# Altium schematic sheet PetroTankMonitor.SchDoc
size A2
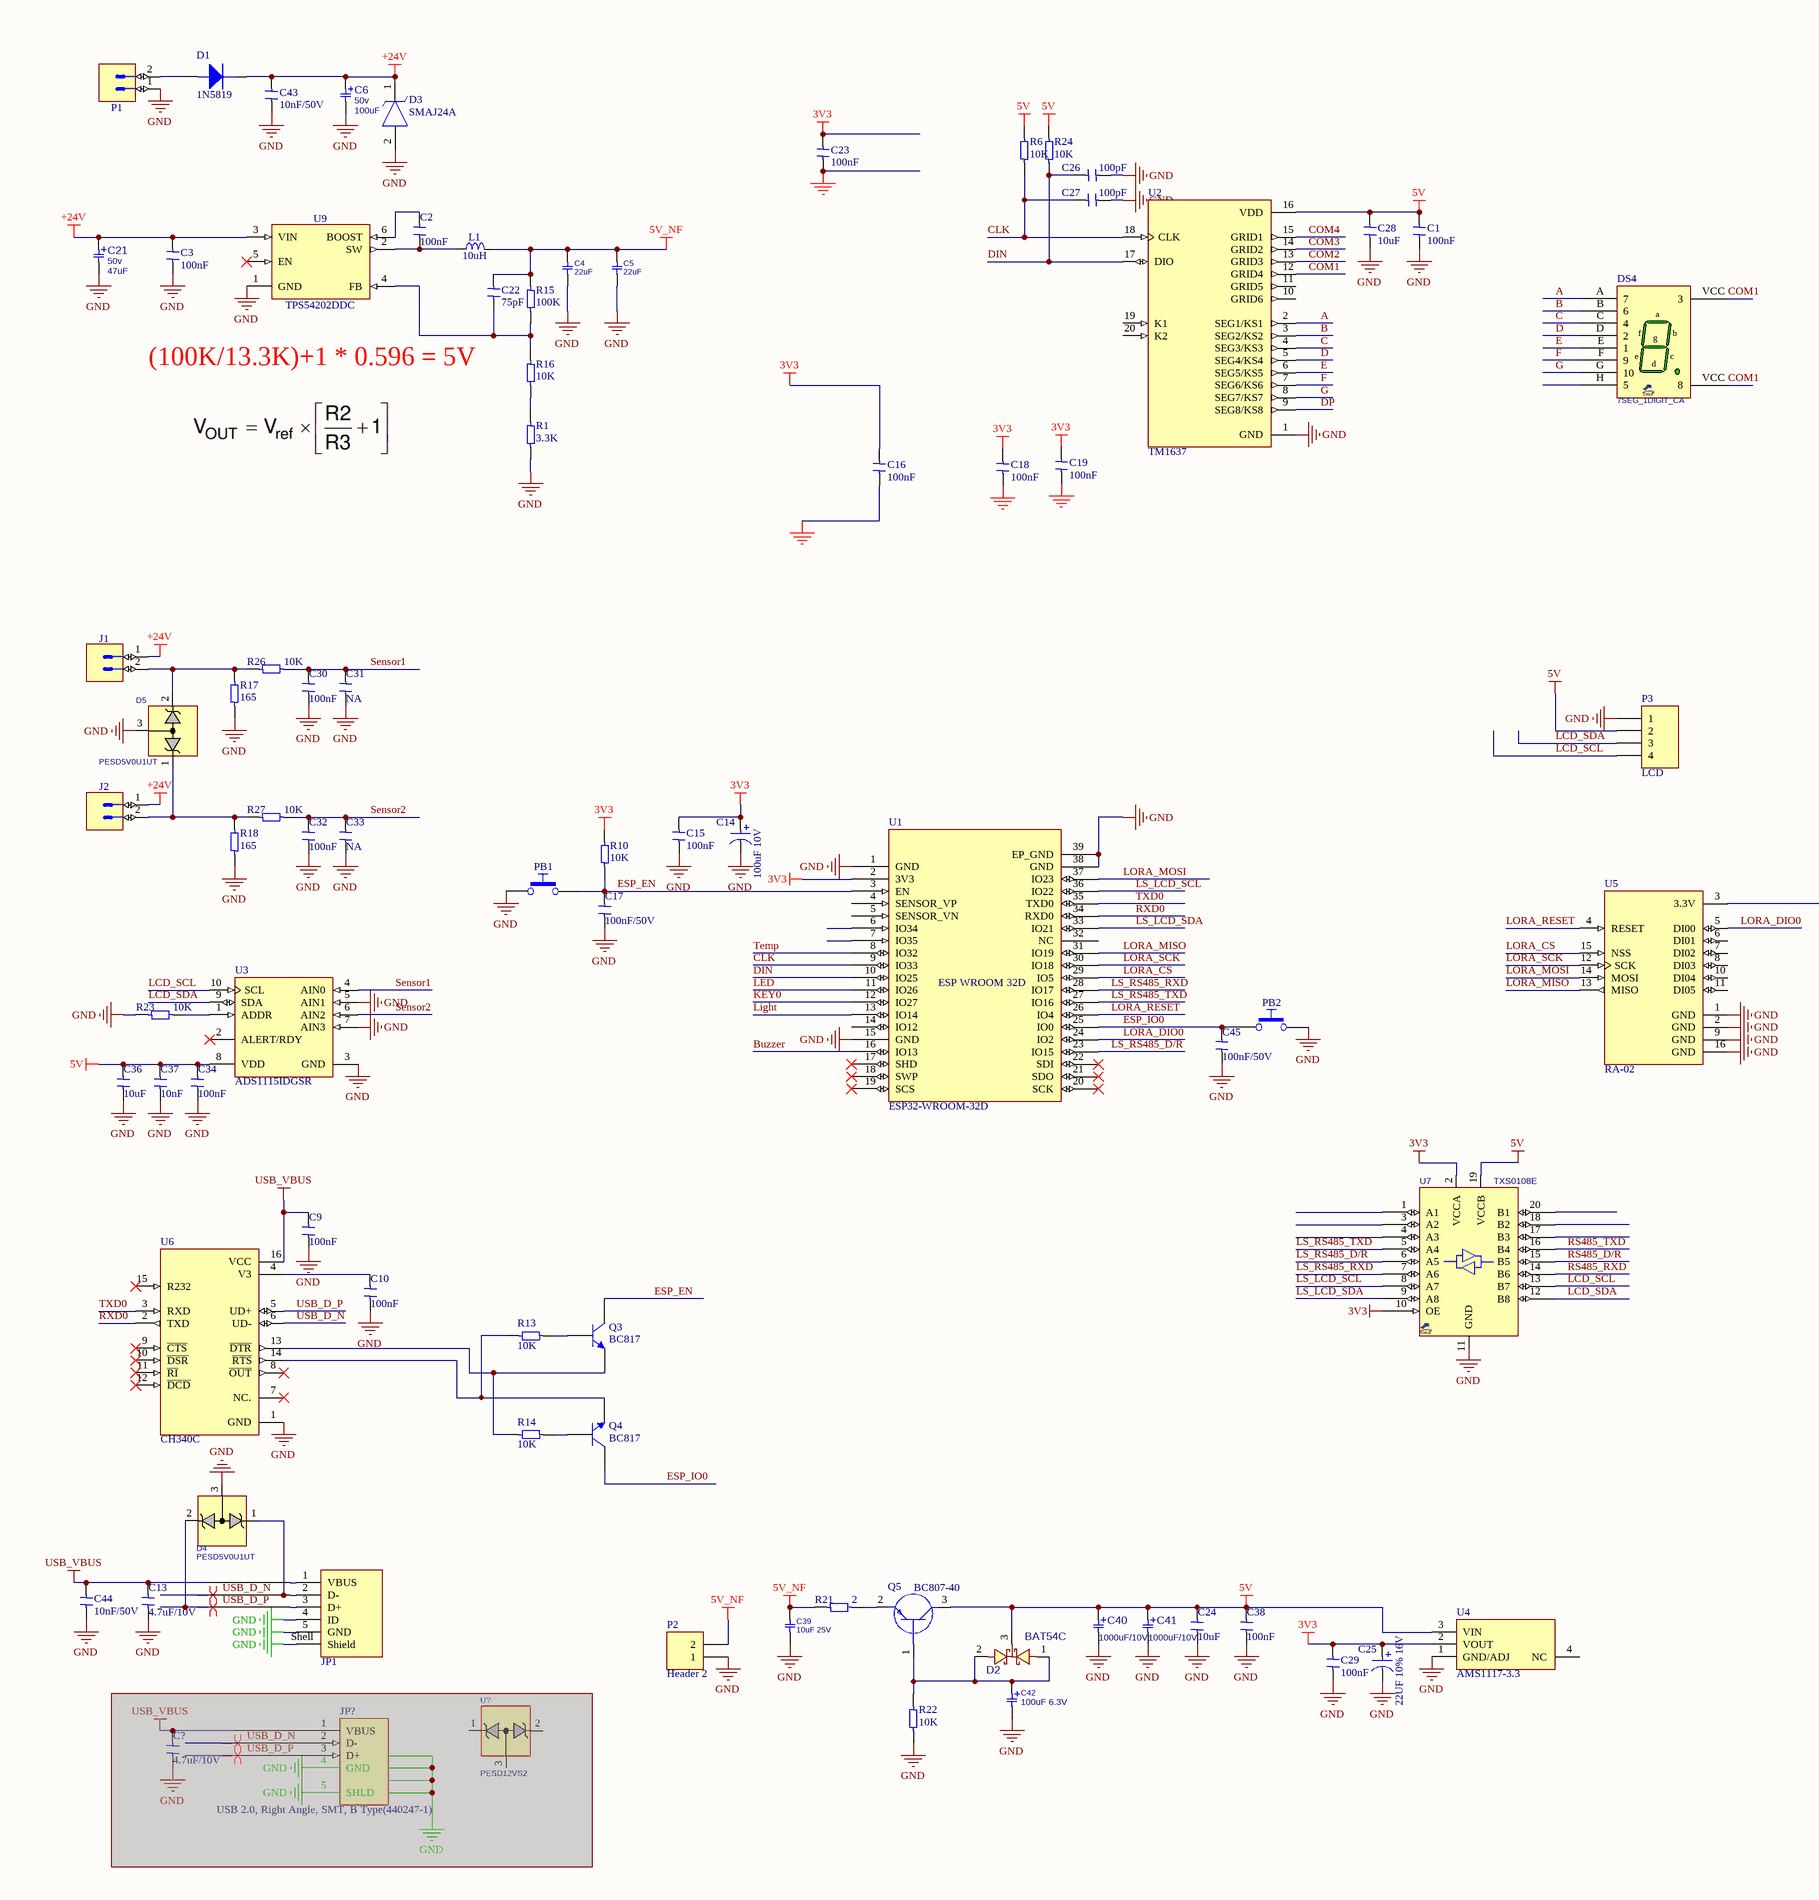
[diagram p0: PetroTankMonitor.SchDoc, left]
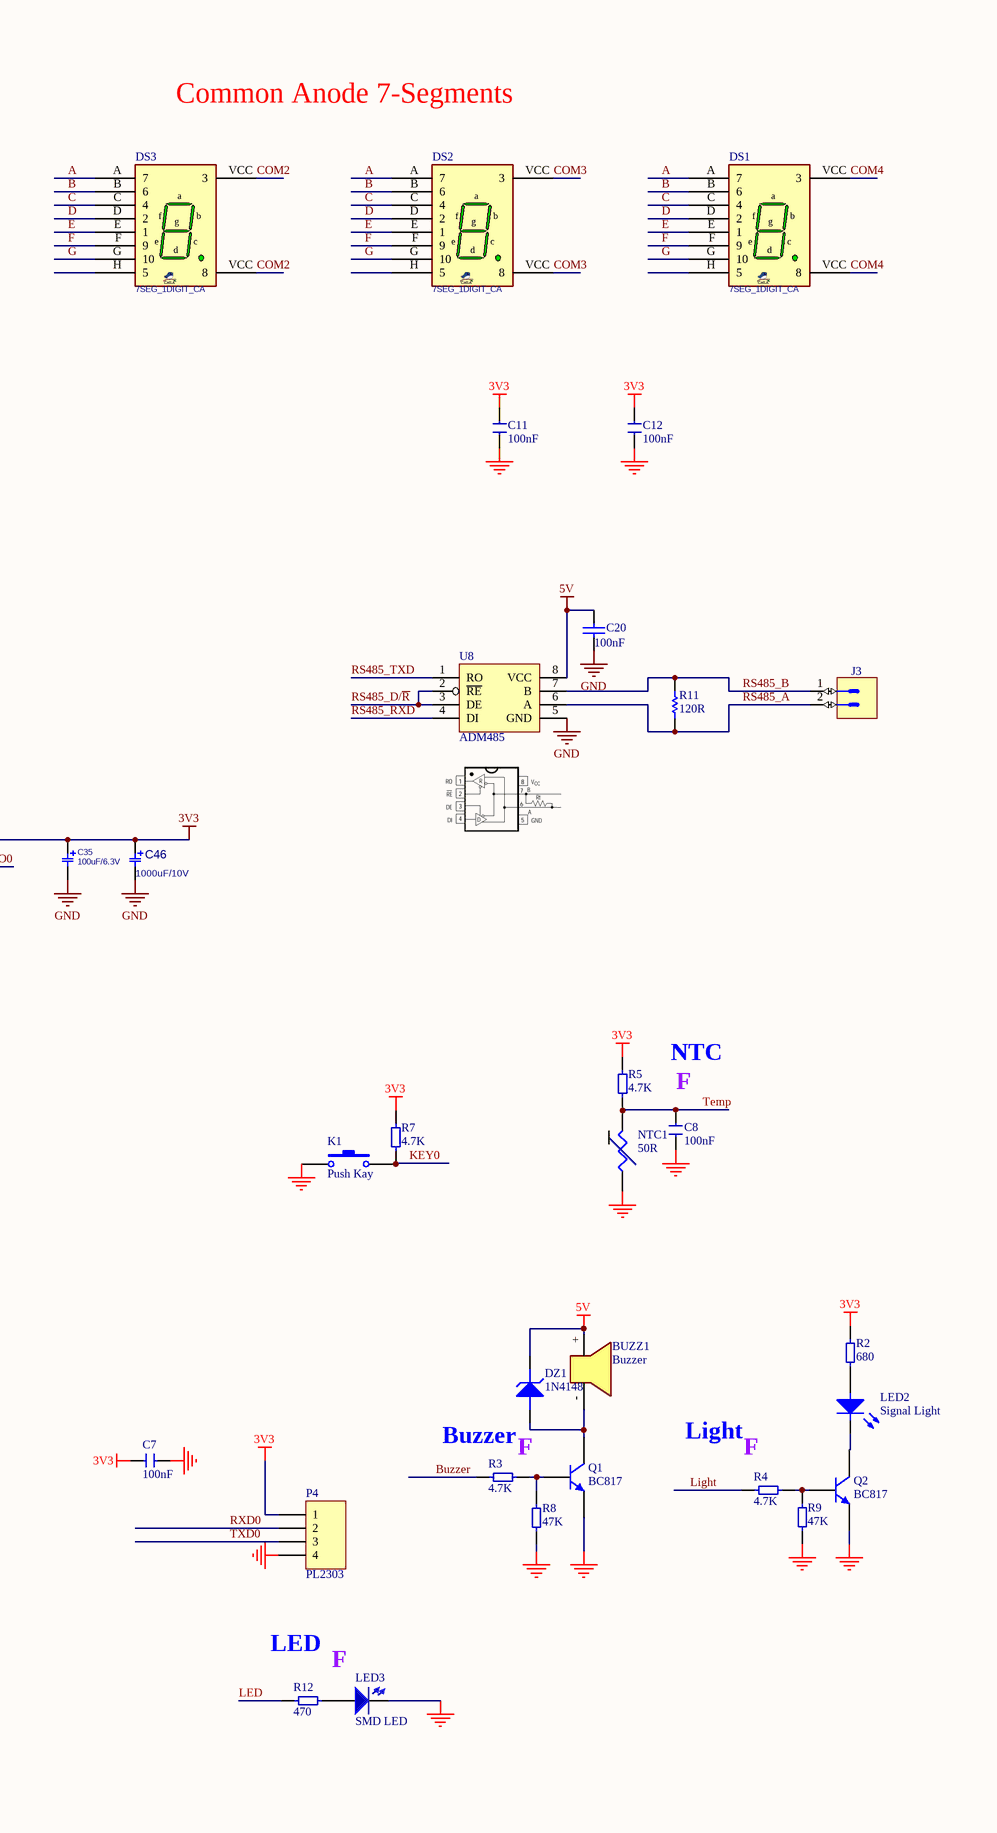
[diagram p1: PetroTankMonitor.SchDoc, right]

## Parts
BUZZ1  Buzzer  [My_Buzzer]
C1  Capacitor SMD  [0805 Capacitor]  (value not drawn)
C2  100nF  [0805 Capacitor]
C3  100nF  [0805 Capacitor]
C4  22uF  [C1206E]
C5  22uF  [C1206E]
C6  PARAM2: 50v  [C_EL_8X12]  (hidden comment: 100uF)
C7  100nF  [0805 Capacitor]
C8  100nF  [0805 Capacitor]
C9  100nF  [0805 Capacitor]
C10  100nF  [0805 Capacitor]
C11  100nF  [0805 Capacitor]
C12  100nF  [0805 Capacitor]
C13  4.7uF/10V  [0805 Capacitor]
C14  100uF 10V  [Tantalum-B]
C15  100nF  [0805 Capacitor]
C16  100nF  [0805 Capacitor]
C17  100nF/50V  [0805 Capacitor]
C18  100nF  [0805 Capacitor]
C19  100nF  [0805 Capacitor]
C20  100nF  [0805 Capacitor]
C21  PARAM2: 50v  [C_EL_6X12]  (hidden comment: 47uF)
C22  75pF  [0805 Capacitor]
C23  100nF  [0805 Capacitor]
C24  10uF  [0805 Capacitor]
C25  22UF 10% 16V  [Tantalum-B]
C26  100pF  [0805 Capacitor]
C27  100pF  [0805 Capacitor]
C28  10uF  [0805 Capacitor]
C29  100nF  [0805 Capacitor]
C30  100nF  [0805 Capacitor]
C31  NA  [0805 Capacitor]
C32  100nF  [0805 Capacitor]
C33  NA  [0805 Capacitor]
C34  100nF  [0805 Capacitor]
C35  100uF/6.3V  [C_TN_7343]
C36  10uF  [0805 Capacitor]
C37  10nF  [0805 Capacitor]
C38  100nF  [0805 Capacitor]
C39  10uF 25V  [C1206E]
C40  1000uF/10V  [C_EL_10X16]
C41  1000uF/10V  [C_EL_10X16]
C42  100uF 6.3V  [C_TN_3528]
C43  10nF/50V  [0805 Capacitor]
C44  10nF/50V  [0805 Capacitor]
C45  100nF/50V  [0805 Capacitor]
C46  1000uF/10V  [C_EL_10X16]
C?  4.7uF/10V  [0805 Capacitor]  (masked out: inside a compile mask, not in the netlist)
D1  1N5819  [$SMD-DO214AC]
D2  BAT54C  [SOT23_3]
D3  SMAJ24A  [DIOM5026X229N]
D4  PESD5V0U1UT  [SOT323_3]
D5  PESD5V0U1UT  [SOT323_3]
DS1  7SEG_1DIGIT_CA  [7SEG_20x27]
DS2  7SEG_1DIGIT_CA  [7SEG_20x27]
DS3  7SEG_1DIGIT_CA  [7SEG_20x27]
DS4  7SEG_1DIGIT_CA  [7SEG_20x27]
DZ1  1N4148  [$SMD-Diode-mini MELF]
J1  (no value)  [PHOENIX_1803277]
J2  (no value)  [PHOENIX_1803277]
J3  (no value)  [PHOENIX_1803277]
JP1  651005136421  [651005136421]  (value not drawn)
JP?  USB 2.0, Right Angle, SMT, B Type(440247-1)  [440247]  (masked out: inside a compile mask, not in the netlist)
K1  Push Kay  [Header H2B-XHA]
L1  10uH  [IND-SMD_L7.3-W6.6]
LED2  Signal Light  [$led-5mm-green]
LED3  SMD LED  [LED_1206 RED]
NTC1  50R  [HDR1X2]
P1  (no value)  [PHOENIX_1757242]
P2  Header 2  [Header H2B-XHA]
P3  LCD  [HDR1X4]
P4  PL2303  [$Header4Female]
PB1  Push Button  [SWPBS_SPST_6X3X2]  (value not drawn)
PB2  Push Button  [SWPBS_SPST_6X3X2]  (value not drawn)
Q1  BC817  [SOT-23]
Q2  BC817  [SOT-23]
Q3  BC817  [SOT-23]
Q4  BC817  [SOT-23]
Q5  BC807-40  [SOT95P230X110-3N]
R1  3.3K  [0805 Resistor]
R2  680  [0805 Resistor]
R3  4.7K  [0805 Resistor]
R4  4.7K  [0805 Resistor]
R5  4.7K  [0805 Resistor]
R6  10K  [0805 Resistor]
R7  4.7K  [0805 Resistor]
R8  47K  [0805 Resistor]
R9  47K  [0805 Resistor]
R10  10K  [0805 Resistor]
R11  120R  [0805 Resistor]
R12  470  [0805 Resistor]
R13  10K  [0805 Resistor]
R14  10K  [0805 Resistor]
R15  100K  [0805 Resistor]
R16  10K  [0805 Resistor]
R17  165  [R1206E]
R18  165  [R1206E]
R21  2  [0805 Resistor]
R22  10K  [0805 Resistor]
R23  10K  [0805 Resistor]
R24  10K  [0805 Resistor]
R26  10K  [0805 Resistor]
R27  10K  [0805 Resistor]
U1  ESP32-WROOM-32D  [ESP32-WROOM-32D]
U2  TM1637  [SOP-20_L12.8-W7.5-P1.27-LS10.4-BL]
U3  ADS1115IDGSR  [TI-DGS10_N]
U4  AMS1117-3.3  [SOT229P700X180-4N]
U5  RA-02  [RA-02]
U6  CH340C  [SOIC127P600X180-16N]
U7  TXS0108E  [SOG65_20]
U8  ADM485  [SO-8N]
U9  TPS54202DDC  [SOT95P280X100-6N]
U?  PESD12VS2  [SOT323_3]  (masked out: inside a compile mask, not in the netlist)

## Nets
3V3: C7.2 C11.2 C12.2 C14.1 C15.2 C16.2 C18.2 C19.2 C23.2 C25.1 C29.2 C35.1 C46.1 P4.1 R2.1 R5.1 R7.1 R10.2 U1.2(3V3) U4.2(VOUT) U5.3(3.3V) U7.2(VCCA) U7.10(OE)
5V: BUZZ1.+ C1.2 C20.2 C24.2 C28.2 C34.2 C36.2 C37.2 C38.2 C40.1 C41.1 D2.3 DZ1.K P3.2 Q5.3(C) R6.2 R24.2 U2.16(VDD) U3.8(VDD) U4.3(VIN) U7.19(VCCB) U8.8(VCC)
5V_NF: C4.2 C5.2 C22.2 C39.2 L1.2 P2.2 R15.1 R21.1
+24V: C3.2 C6.1 C21.1 C43.2 D1.K D3.1(K) J1.1 J2.1 U9.3(VIN)
GND: C1.1 C3.1 C4.1 C5.1 C6.2 C7.1 C8.1 C9.1 C10.1 C11.1 C12.1 C13.1 C14.2 C15.1 C16.1 C17.1 C18.1 C19.1 C20.1 C21.2 C23.1 C24.1 C25.2 C26.1 C27.1 C28.1 C29.1 C30.1 C31.1 C32.1 C33.1 C34.1 C35.2 C36.1 C37.1 C38.1 C39.1 C40.2 C41.2 C42.2 C43.1 C44.1 C45.1 C46.2 D3.2(A) D4.3(GND) D5.3(GND) JP1.4(ID) JP1.5(GND) JP1.Shell(Shield) K1.1 LED3.2(K) NTC1.1 P1.1 P2.1 P3.1 P4.4 PB1.1 PB2.2 Q1.2(E) Q2.2(E) R1.2 R8.1 R9.1 R17.1 R18.1 R22.2 R23.1 U1.1(GND) U1.15(GND) U1.38(GND) U1.39(EP_GND) U2.1(GND) U3.3(GND) U3.5(AIN1) U3.7(AIN3) U4.1(GND/ADJ) U5.1(GND) U5.2(GND) U5.9(GND) U5.16(GND) U6.1(GND) U7.11(GND) U8.5(GND) U9.1(GND)
USB_VBUS: C9.2 C13.2 C44.2 JP1.1(VBUS) U6.16(VCC)
A: DS1.A(7) DS2.A(7) DS3.A(7) DS4.A(7) U2.2(SEG1/KS1)
B: DS1.B(6) DS2.B(6) DS3.B(6) DS4.B(6) U2.3(SEG2/KS2)
Buzzer: R3.1 U1.16(IO13)
C: DS1.C(4) DS2.C(4) DS3.C(4) DS4.C(4) U2.4(SEG3/KS3)
CLK: C27.2 R6.1 U1.9(IO33) U2.18(CLK)
COM1: DS4.VCC(3) U2.12(GRID4)
COM2: DS3.VCC(3) U2.13(GRID3)
COM3: DS2.VCC(3) U2.14(GRID2)
COM4: DS1.VCC(3) U2.15(GRID1)
D: DS1.D(2) DS2.D(2) DS3.D(2) DS4.D(2) U2.5(SEG4/KS4)
DIN: C26.2 R24.1 U1.10(IO25) U2.17(DIO)
DP: U2.9(SEG8/KS8)
E: DS1.E(1) DS2.E(1) DS3.E(1) DS4.E(1) U2.6(SEG5/KS5)
ESP_EN: C17.2 PB1.2 Q3.3(C) R10.1 U1.3(EN)
ESP_IO0: C45.2 PB2.1 Q4.3(C) U1.25(IO0)
F: DS1.F(9) DS2.F(9) DS3.F(9) DS4.F(9) U2.7(SEG6/KS6)
G: DS1.G(10) DS2.G(10) DS3.G(10) DS4.G(10) U2.8(SEG7/KS7)
KEY0: K1.2 R7.2 U1.12(IO27)
LCD_SCL: P3.4 U3.10(SCL) U7.13(B7)
LCD_SDA: P3.3 U3.9(SDA) U7.12(B8)
LED: R12.1 U1.11(IO26)
Light: R4.1 U1.13(IO14)
LORA_CS: U1.29(IO5) U5.15(NSS)
LORA_DIO0: U1.24(IO2) U5.5(DI00)
LORA_MISO: U1.31(IO19) U5.13(MISO)
LORA_MOSI: U1.37(IO23) U5.14(MOSI)
LORA_RESET: U1.26(IO4) U5.4(RESET)
LORA_SCK: U1.30(IO18) U5.12(SCK)
LS_LCD_SCL: U1.36(IO22) U7.8(A7)
LS_LCD_SDA: U1.33(IO21) U7.9(A8)
LS_RS485_D/~{R}: U1.23(IO15) U7.6(A5)
LS_RS485_RXD: U1.28(IO17) U7.7(A6)
LS_RS485_TXD: U1.27(IO16) U7.5(A4)
RS485_A: J3.2 R11.2 U8.6(A)
RS485_B: J3.1 R11.1 U8.7(B)
RS485_D/~{R}: U7.15(B5) U8.2(~{RE}) U8.3(DE)
RS485_RXD: U7.14(B6) U8.4(DI)
RS485_TXD: U7.16(B4) U8.1(RO)
RXD0: P4.2 U1.34(RXD0) U6.2(TXD)
Sensor1: C30.2 C31.2 R26.2 U3.4(AIN0)
Sensor2: C32.2 C33.2 R27.2 U3.6(AIN2)
Temp: C8.2 NTC1.2 R5.2 U1.8(IO32)
TXD0: P4.3 U1.35(TXD0) U6.3(RXD)
USB_D_N: D4.1(IO1) JP1.2(D-) U6.6(UD-)
USB_D_P: D4.2(IO2) JP1.3(D+) U6.5(UD+)
NetBUZZ1_-: BUZZ1.- DZ1.A Q1.3(C)
NetC2_1: C2.1 U9.6(BOOST)
NetC2_2: C2.2 L1.1 U9.2(SW)
NetC10_2: C10.2 U6.4(V3)
NetC22_1: C22.1 R15.2 R16.1 U9.4(FB)
NetC42_1: C42.1 D2.1 D2.2 Q5.1(B) R22.1
NetD1_A: D1.A P1.2
NetD5_1: D5.1(IO1) J2.2 R18.2 R27.1
NetD5_2: D5.2(IO2) J1.2 R17.2 R26.1
NetLED2_A: LED2.A R2.2
NetLED2_K: LED2.K Q2.3(C)
NetLED3_1: LED3.1(A) R12.2
NetQ1_1: Q1.1(B) R3.2 R8.2
NetQ2_1: Q2.1(B) R4.2 R9.2
NetQ3_1: Q3.1(B) R13.1
NetQ3_2: Q3.2(E) R14.2 U6.13(~{DTR})
NetQ4_1: Q4.1(B) R14.1
NetQ4_2: Q4.2(E) R13.2 U6.14(~{RTS})
NetQ5_2: Q5.2(E) R21.2
NetR1_1: R1.1 R16.2
NetR23_2: R23.2 U3.1(ADDR)

Not connected (* = marked no-connect by the designer): DS1 H(5); DS2 H(5); DS3 H(5); DS4 H(5); U1 4(SENSOR_VP) 5(SENSOR_VN) 6(IO34) 7(IO35) 14(IO12) 17(SHD)* 18(SWP)* 19(SCS)* 20(SCK)* 21(SDO)* 22(SDI)* 32(NC); U2 10(GRID6) 11(GRID5) 19(K1) 20(K2); U3 2(ALERT/RDY)*; U4 4(NC); U5 6(DI01) 7(DI02) 8(DI03) 10(DI04) 11(DI05); U6 7(NC.)* 8(~{OUT})* 9(~{CTS})* 10(~{DSR})* 11(~{RI})* 12(~{DCD})* 15(R232)*; U7 1(A1) 3(A2) 4(A3) 17(B3) 18(B2) 20(B1); U9 5(EN)*

## Layout directives
differential pair: (no net found under the mark), USB_D_N, USB_D_P

## Notes on the sheet
- Common Anode 7-Segments
- (near R16) (100K/13.3K)+1 * 0.596 = 5V
- NTC
- (near C8) F
- Buzzer
- (near R4) Light
- F
- (near R4) F
- LED
- (in symbol Capacitor SMD) 100nF
- (in symbol Component_1) ESP WROOM 32D

## Library data of the parts
BUZZ1 = Buzzer: 5-12v small buzzer (12mm)
C2 C3 C7-C13 C15-C19 C22-C24 C26-C34 C36-C38 C43-C45 C? = Capacitor SMD
  C2 C3 C7-C12 C15 C16 C18 C19 C23 C29 C30 C32 C34 C38: Value: 100nF
  C13 C?: Value: 4.7uF/10V
  C17 C45: Value: 100nF/50V
  C22: Value: 75pF
  C24 C36: Value: 10uF
  C26 C27: Value: 100pF
  C31 C33: Value: NA
  C37: Value: 10nF
  C43 C44: Value: 10nF/50V
C4 C5 C39 = CAP_SMD_MLCC_22u25V: CAP, MLCC, X5R 22uF 25V 20% 1206; PARAM: X5R, 20%; MANF_P#: TMK316BBJ226ML-T; MANF: Taiyo Yuden; DESC: CAP, MLCC, 22uF, 25V, X5R,  20%, 1206; PARAM2: 25V; PRICE: 0.572$
  C4 C5: VALUE: 22uF
  C39: VALUE: 10uF 25V
C6 = CAP_THD_EL_100uF_50v: CAP, THD, ELEC,; MANF_P#: MANF_PART#; DESC: DESCRIPTION; DIST#: MOUSER; PARAM: 20%; PRICE: 10= -$; MANF: MANF; ASSEMBLY: ASSEMBLY; VALUE: 100uF
C14 C25 = Cap Pol SMD: CAP TANT 22UF 10% 16V SMD; Manufacturer: AVX Corporation; Manufacturer Part Number: TAJB226K016RNJ; Manufacturer Size Code: B; Current Footprint: 1411 (3528 Metric), 1210; Board Qty: 1000; Type: Molded; ESR (Equivalent Series Resistance): 2.3 Ohm; Notification: Current market demand for these product types have resulted in fluctuating and extending lead times. Lead times may differ.; ITEM/NO: NULL; PCB Name: GS-101; HelpURL: D:\HNA\Datasheet Documents\TAJ.pdf; Supplier 1: Digi-Key; Supplier Part Number 1: 478-1682-2-ND; RoHS: RoHS Compliant; Category: Capacitors; Stock 1: 84000; Pricing 1: 2000=0.1344, 4000=0.126, 10000=0.1176, 14000=0.116 (USD); Packaging: Tape & Reel (TR); Part Status: Active; Tolerance: ±10%; Operating Temperature: -55°C ~ 125°C; Lifetime @ Temp.: -; Mounting Type: Surface Mount; Package / Case: 1411 (3528 Metric), 1210; Size / Dimension: 0.138" L x 0.110" W (3.50mm x 2.80mm); Height - Seated (Max): 0.083" (2.10mm); Lead Spacing: -; Features: General Purpose; Failure Rate: -; ComponentLink1URL: http://datasheets.avx.com/TAJ.pdf; ComponentLink1Description: http://datasheets.avx.com/TAJ.pdf; Pricing: NULL; Supplier: NULL; Supplier Part Number: NULL; Parameter 1: *
  C14: Part Number: 100uF 10V
  C25: Part Number: 22UF 10% 16V
C20 = Cap: Capacitor; PackageReference: RAD-0.3; PackageDescription: Radial Cap, Thru-Hole; 2 Leads; 0.3 in Pin Spacing; Value: 100nF; Part Number: 100nF
C21 = CAP_THD_EL_47uF_50v: CAP, THD, ELEC,; MANF_P#: MANF_PART#; DESC: DESCRIPTION; DIST#: MOUSER; PARAM: 20%; PRICE: 10= -$; MANF: MANF; ASSEMBLY: ASSEMBLY; VALUE: 47uF
C35 = CAP_SMD_TAN_100uF: CAP, SMD, TAN; PARAM: 20%, 50mOhm, -55~105oC; MANF: AVX; MANF_P#: TCJD107M016R0050; PARAM2: 16V; PRICE: 1.9$; VALUE: 100uF/6.3V
C40 C41 C46 = CAP_THD_EL_1000uF_16v: CAP, THD, ELEC,; MANF_P#: MANF_PART#; DESC: DESCRIPTION; DIST#: MOUSER; PARAM: 20%; PARAM2: 16v; PRICE: 10= -$; MANF: MANF; ASSEMBLY: ASSEMBLY; VALUE: 1000uF/10V
C42 = CAP_SMD_TAN_3528: CAP, SMD, TAN,; PARAM2: -V; VALUE: 100uF 6.3V
D1 = Diode$
D2 = DIODE_SMD_SCHOTTKY_BAT54C: DIODE, SCHOTTKY, DUAL, 30V, 0.2A; MANF: Diodes; MANF_P#: BAT54C-7-F; DESC: DESCRIPTION; PARAM: 30V/200MW; ASSEMBLY: ASSEMBLY; PRICE: PRICE; PARAM2: 0.2A; VALUE: BAT54C
D3 = SMAJ24A: TVS Diode (Uni-directional); Manufacturer_Name: LITTELFUSE; Datasheet Link: https://componentsearchengine.com/Datasheets/2/SMAJ24A.pdf; Height: 2.29mm; Manufacturer_Part_Number: SMAJ24A; Mouser Part Number: 576-SMAJ24A; Mouser Price/Stock: https://www.mouser.co.uk/ProductDetail/Littelfuse/SMAJ24A?qs=HR2RnyOI4E78ZevQKM2hdA%3D%3D; Arrow Part Number: SMAJ24A; Arrow Price/Stock: https://www.arrow.com/en/products/smaj24a/littelfuse?region=nac
D4 D5 U? = TVS_X2_PESD12VS2: TVS, ESD PROTECT, 2CH, 15VBR, 0.2W; MANF_P#: PESD12VS2UQ,115; MANF: Nexperia; PARAM: 15VBR, -65~105oC; PRICE: 0.5$
  D4 D5: VALUE: PESD5V0U1UT
  U?: VALUE: PESD12VS2
DS1-DS4 = 7SEG_1DIGIT_CA_GRN_7MM: 7SEGMENT, 1DIGIT, common ANODE; MANF: Kingbright; MANF_P#: ACSA02-41SGWA-F01; PARAM: 20mA, 2.2v, -40~85oC; PRICE: 2.5$; VALUE: 7SEG_1DIGIT_CA
DZ1 = Diode Zener$
J1-J3 = PHOENIX_1803277: Connector 2 Male; Part Description: 8A 160 V, Pitch: 3.81mm, 2 Positions  Right Angled Header; Manufacturer: PHOENIX CONTACT; Manufacturer Part Number: 1803277 (MC 1,5/ 2-G-3,81); PressFit: No; Part Number: PHOENIX_1803277; Component Kind: Standard; Component Type: Standard; Pin Count: 2; Mounted: Yes; Socket: No; SMD: No; Sense: No; Status: None; ComponentHeight: 7.25mm; HelpURL: \\cern.ch\dfs\Applications\Altium\Datasheets\PHOENIX_1803277.pdf; Author: CERN DEM JLC; CreateDate: 5/6/2014; LatestRevisionDate: 5/6/2014
JP1 = 651005136421: WR-COM Mini USB 2.0 Type B Vertical 5 Contacts; Manufacturer: Wurth Elektronik; Match Code: WR-USB; Gender: Receptacle; Interface Type: Type B; Number of Ports: 1; Rated Current: 1A; Working Voltage: 30V (AC); Manufacturer Part Number: 651005136421; Category: Input/Output Connectors; ComponentLink1Description: Website Link; ComponentLink1URL: https://www.we-online.com/redexpert/article/651005136421?ad; ComponentLink2Description: Datasheet Link; ComponentLink2URL: https://www.we-online.com/redexpert/spec/651005136421?ad; Mount: Through Hole; Operating Temperature Max: 105°C; Operating Temperature Min: -40°C; Packaging: Tray; Application: Mini USB 2.0; Number of Pins: 5; Orientation: Vertical
JP? = 440247-1: USB 2.0, Right Angle, SMT, B Type, Receptacle, 5 Position, Black; ContactMaterial: Copper Alloy; ContactPlating: Gold (30); PCB_Layout: Complies with manufacturer's recommendation.; DrillSize: Corresponds to nominal value.; PanelGround: Without; Current Footprint: SMD (Surface Mount, Right Angle); Assembly Status: A; Published: 15-Jul-2004; DatasheetDocument: 27-Jun-2003; PackageDocument: 27-Jun-2003; PackageReference: 440247; Publisher: Altium Limited; HousingMaterial: Thermoplastic; ComponentLink1Description: Manufacturer Link; ComponentLink1URL: http://www.tycoelectronics.com/; ComponentLink2Description: Packaging Specification; ComponentLink2URL: http://ecommas.tycoelectronics.com/commerce/DocumentDelivery/DDEController?Action=showdoc&DocId=Customer+Drawing%7F440247%7FD%7Fpdf%7FEnglish%7FC_440247_D.pdf; Manufacturer: *; Price: 0.082$
L1 = IND1008_1UH_20%_WURTH_74479787210B: Inductor; Part Description: Power Multilayer Inductor (WE-PMI Series); Manufacturer: WURTH ELEKTRONIK; Power: 1.95A; Resistance: 0.06R; Tolerance: ±20%; Part Number: IND1008_1UH_20%_WURTH_74479787210B; Component Kind: Standard; Component Type: Standard; Footprint: INDC2620X100N; Pin Count: 2; Value: 10uH; Manufacturer Part Number: 74479787210B; Case: 1008; Mounted: Yes; Socket: No; SMD: Yes; Sense: No; ComponentHeight: 1mm; HelpURL: \\cern.ch\dfs\Applications\Altium\Datasheets\IND_WURTH_WE-PMI_74479787210B.pdf; Author: CERN DEM JLC; CreateDate: 10/1/2014; LatestRevisionDate: 10/1/2014
LED2 = LED$
LED3 = LED SMD
NTC1 = NTC power: NTC , 50R-13mm disc type; Device Code: 143161
P1 = PHOENIX_1757242: Connector 2 Male; Part Description: 12A, 250V, Pitch 5.08mm, 2 Positions Header; Manufacturer: PHOENIX CONTACT; Manufacturer Part Number: 1757242 (MSTBA 2,5/ 2-G-5,08); PressFit: No; Part Number: PHOENIX_1757242; Component Kind: Standard; Component Type: Standard; Pin Count: 2; Mounted: Yes; Socket: No; SMD: No; Sense: No; Status: None; ComponentHeight: 8.6mm; HelpURL: \\cern.ch\dfs\Applications\Altium\Datasheets\PHOENIX_1757242.pdf; Author: CERN DEM JLC; CreateDate: 9/21/2016; LatestRevisionDate: 9/21/2016
P2 = Header 2: Header, 2-Pin; LatestRevisionDate: 17-Jul-2002; LatestRevisionNote: Re-released for DXP Platform.; Publisher: Altium Limited
P3 P4 = Header 4: Header, 4-Pin; LatestRevisionDate: 17-Jul-2002; LatestRevisionNote: Re-released for DXP Platform.; Publisher: Altium Limited
PB1 PB2 = PB_TYCO_FSMSM: Push-Button Switch SPDT; Part Description: 12VDC 50mA SPST Tactile  Push-Button Switch; Manufacturer: TYCO ELECTRONICS; Manufacturer Part Number: FSMSM or 1437566-3; PressFit: No; Part Number: PB_TYCO_FSMSM; Component Kind: Standard; Component Type: Standard; Footprint: PB_TYCO_FSMSM; Pin Count: 2; PackageDescription: Body 3.5x6.0mm, Pushbutton Switch,  TYCO ALCOSWITCH FSMSM Serie; Family: Push Button; Mounted: Yes; Socket: No; SMD: Yes; Sense: No; Status: None; ComponentHeight: 4.3mm; HelpURL: \\cern.ch\dfs\Applications\Altium\Datasheets\PB_TYCO_FSMSM.pdf; Author: CERN DEM JLC; CreateDate: 6/30/2008; LatestRevisionDate: 6/21/2012
Q5 = BC807-40,215: Transistor BJT PNP; Manufacturer_Name: Nexperia; Datasheet Link: https://assets.nexperia.com/documents/data-sheet/BC807_SER.pdf; Height: 1.1mm; Manufacturer_Part_Number: BC807-40,215; Mouser Part Number: 771-BC807-40-T/R; Mouser Price/Stock: https://www.mouser.co.uk/ProductDetail/Nexperia/BC807-40215?qs=me8TqzrmIYUR795aoYEBCw%3D%3D; Arrow Part Number: BC807-40,215; Arrow Price/Stock: https://www.arrow.com/en/products/bc807-40215/nexperia?region=europe
R1-R10 R12-R18 R21-R24 R26 R27 = Resistor SMD
  R1: Value: 3.3K
  R2: Value: 680
  R3-R5 R7: Value: 4.7K
  R6 R10 R13 R14 R16 R22-R24 R26 R27: Value: 10K
  R8 R9: Value: 47K
  R12: Value: 470
  R15: Value: 100K
  R17 R18: Value: 165
  R21: Value: 2
R11 = Res1: Resistor; PackageReference: AXIAL-0.3; PackageDescription: Axial Device, Thru-Hole; 2 Leads; 0.3 in Pin Spacing; Value: 120R; Part Number: 120R
U1 = Component_1
U2 = TM1637: LED Drive Control Special Circuit; MF: Titan Micro Electronics; SnapEDA_Link: https://www.snapeda.com/parts/TM1637/Titan+Micro+Electronics/view-part/?ref=snap; Package: None; Value: *; MP: TM1637; Check_prices: https://www.snapeda.com/parts/TM1637/Titan+Micro+Electronics/view-part/?ref=eda
U3 = ADS1115IDGSR: 16-Bit ADC with Integrated Multiplexer, PGA, Comparator, Oscillator, and Reference, -40 to 125 degC, 10-pin SOP (DGS10), Green (RoHS & no Sb/Br); Manufacturer: Texas Instruments; # Input Channels: 4; Analog Voltage AV/DD(Max)(V): 5.5; Analog Voltage AV/DD(Min)(V): 2; Architecture: Delta-Sigma; INL(Max)(+/-LSB): 1; Interface: Serial I2C; Resolution(Bits): 16; Sample Rate (max)(SPS): 860; SubFamily: Precision ADC (<=10MSPS); DatasheetVersion: SBAS444B; PackageVersion: 4073272/C, 02/2004; PackageReference: DGS10; PackageDescription: 10-Pin Plastic Small Outline, Body 3 x 3 mm, Pitch 0.5 mm; Supplier 1: Digi-Key; Supplier Part Number 1: 296-13060-2-ND; Supplier 2: Digi-Key; Supplier Part Number 2: 296-13060-1-ND; Supplier 3: Digi-Key; Supplier Part Number 3: 296-13060-6-ND; Supplier 4: Newark; Supplier Part Number 4: 74C7007; Supplier 5: Mouser; Supplier Part Number 5: 595-ADS1253E/2K5; Digital Supply(Max)(V): 5.5; Digital Supply(Min)(V): 2; Eco-Plan: Green (RoHS & no Sb/Br); Mounting Technology: Surface Mount; Code_JEDEC: MO-153; PartNumber: ADS1115IDGSR; ComponentLink1Description: Manufacturer URL; ComponentLink1URL: http://www.ti.com/; ComponentLink2Description: Datasheet; ComponentLink2URL: http://www.ti.com/general/docs/lit/getliterature.tsp?genericPartNumber=ADS1115&fileType=pdf; ComponentLink3Description: Package Specification; ComponentLink3URL: http://www.ti.com/lit/ml/mpds035b/mpds035b.pdf
U4 = AMS1117-3.3: Integrated Circuit; Manufacturer_Name: Advanced; Datasheet Link: https://datasheet.datasheetarchive.com/originals/distributors/Datasheets-28/DSA-550594.pdf; Height: 1.8mm; Manufacturer_Part_Number: AMS1117-3.3
U5 = RA-02: General ISM < 1GHz LoRaâ„¢ Transceiver Module 410MHz ~ 525MHz Antenna Not Included, I-PEX Surface Mount; MF: Ai-Thinker; Package: None; Price: None; Value: *; SnapEDA_Link: https://www.snapeda.com/parts/RA-02/AI-Thinker/view-part/?ref=snap; MP: RA-02; Availability: Not in stock; Check_prices: https://www.snapeda.com/parts/RA-02/AI-Thinker/view-part/?ref=eda
U6 = CH340C: USB to serial chip CH340; MF: WCH; Price: None; Availability: Not in stock; MP: CH340C; Package: None; SnapEDA_Link: https://www.snapeda.com/parts/CH340C/WCH/view-part/?ref=snap; Check_prices: https://www.snapeda.com/parts/CH340C/WCH/view-part/?ref=eda; Value: *
U7 = TXS0108_SSOP20: Level Translator, Octal; MANF: Texas Instruments; MANF_P#: TXS0108EPWR; VALUE: TXS0108E
U8 = MAX485: MAX3483
U9 = TPS54202DDC: 4.5V to 28V Input, 2-A Output, EMI Friendly / Synchronous Step Down Converter; Part Description: 4.5V to 28V Input, 2A Output, EMI Friendly Synchronous Step Down Converter; Manufacturer: TEXAS INSTRUMENTS; PressFit: No; Bonding: No; Part Number: TPS54202DDC; Component Kind: Standard; Component Type: Standard; Device: TPS54202DDC; PackageDescription: SOT23, 0.95mm Pitch; 6 Pin, 1.625mm W X 2.90mm L X 1.00mm H body, IPC Medium Density; Manufacturer Part Number: TPS54202DDC; Pin Count: 5; Case: SOT23-6; Mounted: Yes; Socket: No; SMD: Yes; Sense: No; ComponentHeight: 1.1mm; HelpURL: \\cern.ch\dfs\Applications\Altium\Datasheets\TPS54202.pdf; Author: CERN DEM HF; CreateDate: 6/10/2022; LatestRevisionDate: 6/10/2022